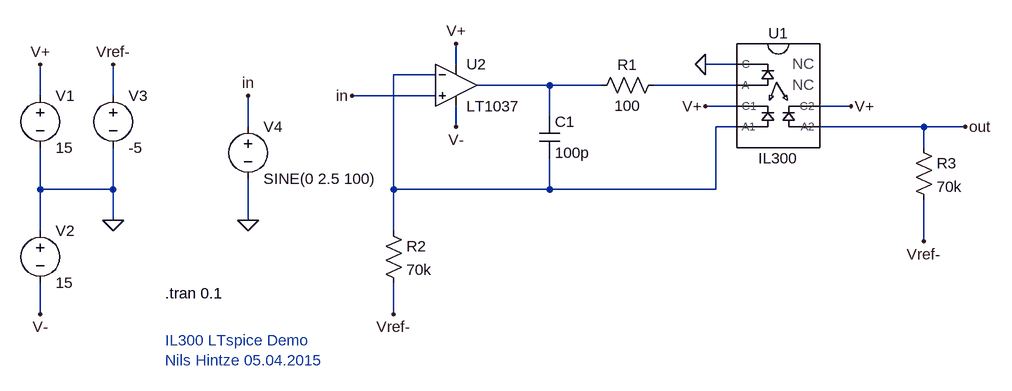
[diagram p0: schematic IL300-jig.asc]
IL300-jig.asc, the LTspice schematic file:
Version 4
SHEET 1 880 680
WIRE -272 48 -272 16
WIRE 160 48 112 48
WIRE -304 64 -368 64
WIRE -128 80 -240 80
WIRE -48 80 -128 80
WIRE 160 80 32 80
WIRE -912 96 -912 48
WIRE -800 96 -800 48
WIRE -304 96 -432 96
WIRE 160 112 112 112
WIRE 336 112 288 112
WIRE -128 128 -128 80
WIRE -592 144 -592 96
WIRE -272 144 -272 112
WIRE 160 144 128 144
WIRE 448 144 288 144
WIRE 512 144 448 144
WIRE 448 176 448 144
WIRE -912 240 -912 176
WIRE -800 240 -800 176
WIRE -800 240 -912 240
WIRE -368 240 -368 64
WIRE -128 240 -128 192
WIRE -128 240 -368 240
WIRE 128 240 128 144
WIRE 128 240 -128 240
WIRE -800 288 -800 240
WIRE -592 288 -592 224
WIRE -912 304 -912 240
WIRE -368 304 -368 240
WIRE 448 320 448 256
WIRE -912 432 -912 384
WIRE -368 432 -368 384
FLAG 112 48 0
FLAG -800 288 0
FLAG -912 48 V+
FLAG -912 432 V-
FLAG 112 112 V+
FLAG -800 48 Vref-
FLAG -368 432 Vref-
FLAG -432 96 in
FLAG -272 16 V+
FLAG -272 144 V-
FLAG 336 112 V+
FLAG 448 320 Vref-
FLAG 512 144 out
FLAG -592 288 0
FLAG -592 96 in
SYMBOL Opamps\\LT1037 -272 16 R0
SYMATTR InstName U2
SYMBOL res 48 64 R90
WINDOW 0 0 56 VBottom 2
WINDOW 3 32 56 VTop 2
SYMATTR InstName R1
SYMATTR Value 100
SYMBOL res -384 288 R0
SYMATTR InstName R2
SYMATTR Value 70k
SYMBOL voltage -912 80 R0
WINDOW 123 0 0 Left 2
WINDOW 39 0 0 Left 2
SYMATTR InstName V1
SYMATTR Value 15
SYMBOL voltage -912 288 R0
WINDOW 123 0 0 Left 2
WINDOW 39 0 0 Left 2
SYMATTR InstName V2
SYMATTR Value 15
SYMBOL cap -144 128 R0
SYMATTR InstName C1
SYMATTR Value 100p
SYMBOL voltage -800 80 R0
WINDOW 123 0 0 Left 2
WINDOW 39 0 0 Left 2
SYMATTR InstName V3
SYMATTR Value -5
SYMBOL res 432 160 R0
SYMATTR InstName R3
SYMATTR Value 70k
SYMBOL voltage -592 128 R0
WINDOW 123 0 0 Left 2
WINDOW 39 0 0 Left 2
SYMATTR InstName V4
SYMATTR Value SINE(0 2.5 100)
SYMBOL _PERSONAL\\opto\\IL300 224 96 R0
SYMATTR InstName U1
TEXT -720 400 Left 2 !.tran 0.1
TEXT -720 472 Left 2 ;IL300 LTspice Demo\nNils Hintze 05.04.2015

The netlist it stands for:
* IL300-jig.asc
XU2 in N001 V+ V- N002 LT1037  ; pins In+ In- V+ V- OUT
R1 N003 N002 100
R2 N001 Vref- 70k
V1 V+ 0 15
V2 0 V- 15
C1 N002 N001 100p
V3 Vref- 0 -5
R3 out Vref- 70k
V4 in 0 SINE(0 2.5 100)
XU1 N003 0 N001 V+ out V+ IL300 IL300  ; pins A C A1 C1 A2 C2
.tran 0.1
* IL300 LTspice Demo
* Nils Hintze 05.04.2015
.lib ..\sym\_PERSONAL\opto\IL300.sub
.backanno
.end